# EAGLE design AccelTestJig (EAGLE 7.6.0)
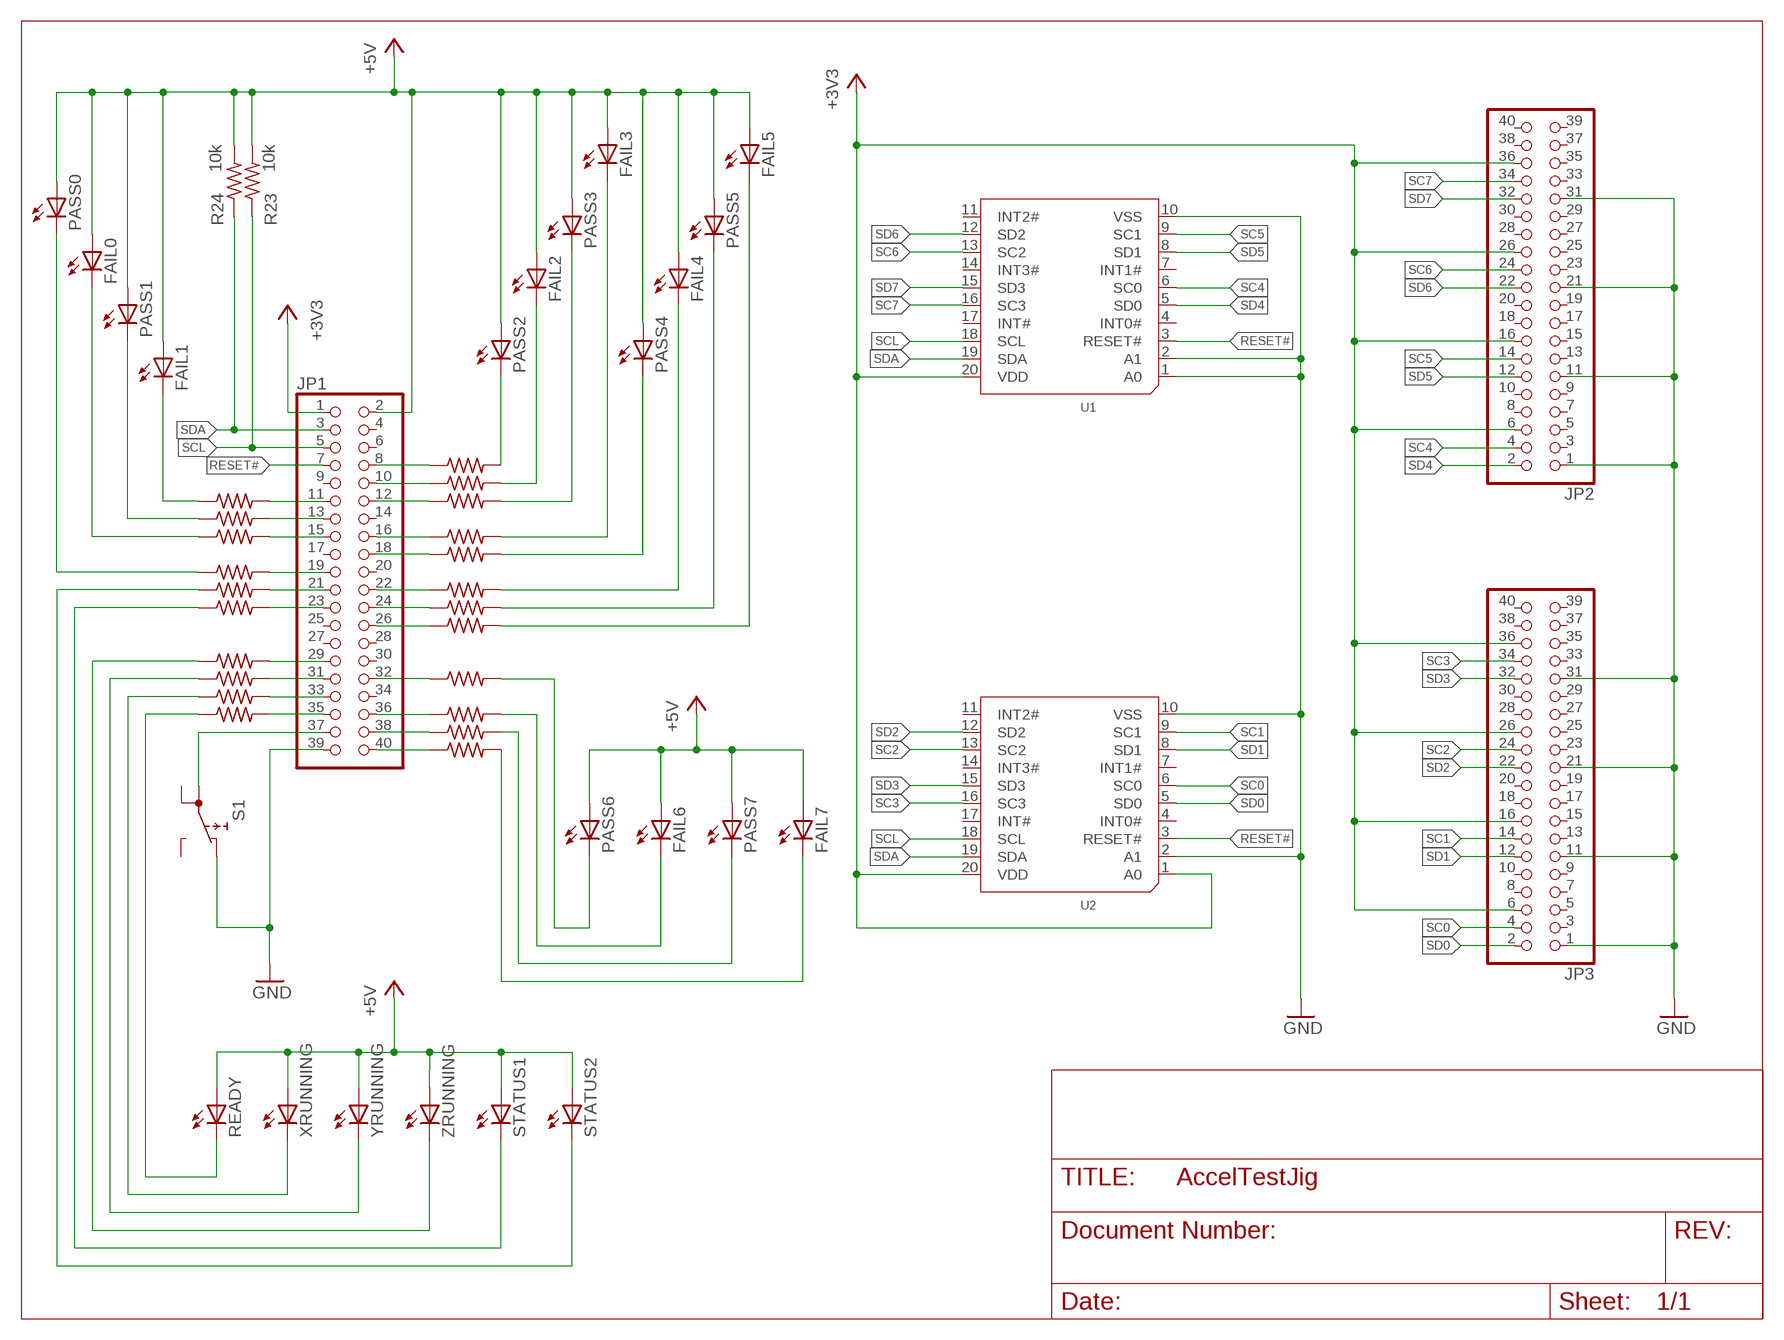
[diagram p0: schematic, sheet 1]

## Parts
FAIL0  FAIL  LEDCHIPLED_0805  [CHIPLED_0805]
FAIL1  FAIL  LEDCHIPLED_0805  [CHIPLED_0805]
FAIL2  FAIL  LEDCHIPLED_0805  [CHIPLED_0805]
FAIL3  FAIL  LEDCHIPLED_0805  [CHIPLED_0805]
FAIL4  FAIL  LEDCHIPLED_0805  [CHIPLED_0805]
FAIL5  FAIL  LEDCHIPLED_0805  [CHIPLED_0805]
FAIL6  FAIL  LEDCHIPLED_0805  [CHIPLED_0805]
FAIL7  FAIL  LEDCHIPLED_0805  [CHIPLED_0805]
JP1  NONE  PINHD-2X20  [2X20]
JP2  NONE  PINHD(2X20-WIDE)  [2X20-WIDE]
JP3  NONE  PINHD(2X20-WIDE)  [2X20-WIDE]
PASS0  PASS  LEDCHIPLED_0805  [CHIPLED_0805]
PASS1  PASS  LEDCHIPLED_0805  [CHIPLED_0805]
PASS2  PASS  LEDCHIPLED_0805  [CHIPLED_0805]
PASS3  PASS  LEDCHIPLED_0805  [CHIPLED_0805]
PASS4  PASS  LEDCHIPLED_0805  [CHIPLED_0805]
PASS5  PASS  LEDCHIPLED_0805  [CHIPLED_0805]
PASS6  PASS  LEDCHIPLED_0805  [CHIPLED_0805]
PASS7  PASS  LEDCHIPLED_0805  [CHIPLED_0805]
R1  100  R-US_R0805  [R0805]
R2  100  R-US_R0805  [R0805]
R3  100  R-US_R0805  [R0805]
R4  100  R-US_R0805  [R0805]
R5  100  R-US_R0805  [R0805]
R6  100  R-US_R0805  [R0805]
R7  100  R-US_R0805  [R0805]
R8  100  R-US_R0805  [R0805]
R9  100  R-US_R0805  [R0805]
R10  100  R-US_R0805  [R0805]
R11  100  R-US_R0805  [R0805]
R12  100  R-US_R0805  [R0805]
R13  100  R-US_R0805  [R0805]
R14  100  R-US_R0805  [R0805]
R15  100  R-US_R0805  [R0805]
R16  100  R-US_R0805  [R0805]
R17  100  R-US_R0805  [R0805]
R18  100  R-US_R0805  [R0805]
R19  100  R-US_R0805  [R0805]
R20  100  R-US_R0805  [R0805]
R21  100  R-US_R0805  [R0805]
R22  100  R-US_R0805  [R0805]
R23  10k  R-US_R0805  [R0805]
R24  10k  R-US_R0805  [R0805]
READY  READY  LEDCHIPLED_0805  [CHIPLED_0805]
S1  START  PUSHBUTTON(6X6SMD)01  [6X6SMD]
STATUS1  NONE  LEDCHIPLED_0805  [CHIPLED_0805]
STATUS2  NONE  LEDCHIPLED_0805  [CHIPLED_0805]
U1  NONE  PCA9545(SOIC20)  [SOIC20]
U2  NONE  PCA9545(SOIC20)  [SOIC20]
XRUNNING  TESTING X  LEDCHIPLED_0805  [CHIPLED_0805]
YRUNNING  TESTING Y  LEDCHIPLED_0805  [CHIPLED_0805]
ZRUNNING  TESTING Z  LEDCHIPLED_0805  [CHIPLED_0805]

## Nets
+3V3: JP1.1 JP2.6 JP2.16 JP2.26 JP2.36 JP3.6 JP3.16 JP3.26 JP3.36 U1.20(VDD) U2.1(A0) U2.20(VDD)
+5V: FAIL0.A FAIL1.A FAIL2.A FAIL3.A FAIL4.A FAIL5.A FAIL6.A FAIL7.A JP1.2 PASS0.A PASS1.A PASS2.A PASS3.A PASS4.A PASS5.A PASS6.A PASS7.A R23.2 R24.2 READY.A STATUS1.A STATUS2.A XRUNNING.A YRUNNING.A ZRUNNING.A
GND: JP1.39 JP2.1 JP2.11 JP2.21 JP2.31 JP3.1 JP3.11 JP3.21 JP3.31 S1.P$2 U1.1(A0) U1.2(A1) U1.10(VSS) U2.2(A1) U2.10(VSS)
N$1: JP1.11 R16.2
N$2: JP1.13 R17.2
N$3: JP1.15 R18.2
N$13: FAIL7.C R15.2
N$14: FAIL1.C R16.1
N$15: PASS1.C R17.1
N$16: FAIL0.C R18.1
N$17: JP1.19 R19.2
N$18: PASS0.C R19.1
N$19: JP1.8 R1.1
N$20: JP1.10 R2.1
N$21: JP1.12 R14.1
N$22: PASS2.C R1.2
N$23: FAIL2.C R2.2
N$24: PASS3.C R14.2
N$25: FAIL3.C R3.2
N$26: PASS4.C R4.2
N$27: FAIL4.C R5.2
N$28: PASS5.C R6.2
N$29: FAIL5.C R7.2
N$30: PASS7.C R10.2
N$31: FAIL6.C R9.2
N$32: PASS6.C R8.2
N$33: JP1.16 R3.1
N$34: JP1.18 R4.1
N$35: JP1.22 R5.1
N$36: JP1.24 R6.1
N$37: JP1.26 R7.1
N$38: JP1.32 R8.1
N$39: JP1.36 R9.1
N$40: JP1.38 R10.1
N$41: JP1.40 R15.1
N$42: R22.1 READY.C
N$43: R21.1 XRUNNING.C
N$44: R13.1 YRUNNING.C
N$46: R11.1 STATUS1.C
N$47: R20.1 STATUS2.C
N$48: JP1.21 R20.2
N$49: JP1.23 R11.2
N$50: JP1.29 R12.2
N$51: JP1.31 R13.2
N$52: JP1.33 R21.2
N$53: JP1.35 R22.2
N$54: JP1.37 S1.P$1
RESET#: JP1.7 U1.3(RESET#) U2.3(RESET#)
SC0: JP3.4 U2.6(SC0)
SC1: JP3.14 U2.9(SC1)
SC2: JP3.24 U2.13(SC2)
SC3: JP3.34 U2.16(SC3)
SC4: JP2.4 U1.6(SC0)
SC5: JP2.14 U1.9(SC1)
SC6: JP2.24 U1.13(SC2)
SC7: JP2.34 U1.16(SC3)
SCL: JP1.5 R23.1 U1.18(SCL) U2.18(SCL)
SD0: JP3.2 U2.5(SD0)
SD1: JP3.12 U2.8(SD1)
SD2: JP3.22 U2.12(SD2)
SD3: JP3.32 U2.15(SD3)
SD4: JP2.2 U1.5(SD0)
SD5: JP2.12 U1.8(SD1)
SD6: JP2.22 U1.12(SD2)
SD7: JP2.32 U1.15(SD3)
SDA: JP1.3 R24.1 U1.19(SDA) U2.19(SDA)
ZRUNNING: R12.1 ZRUNNING.C
Unconnected: JP1.4 JP1.6 JP1.9 JP1.14 JP1.17 JP1.20 JP1.25 JP1.27 JP1.28 JP1.30 JP1.34 JP2.3 JP2.5 JP2.7 JP2.8 JP2.9 JP2.10 JP2.13 JP2.15 JP2.17 JP2.18 JP2.19 JP2.20 JP2.23 JP2.25 JP2.27 JP2.28 JP2.29 JP2.30 JP2.33 JP2.35 JP2.37 JP2.38 JP2.39 JP2.40 JP3.3 JP3.5 JP3.7 JP3.8 JP3.9 JP3.10 JP3.13 JP3.15 JP3.17 JP3.18 JP3.19 JP3.20 JP3.23 JP3.25 JP3.27 JP3.28 JP3.29 JP3.30 JP3.33 JP3.35 JP3.37 JP3.38 JP3.39 JP3.40 S1.P$3 S1.P$4 U1.4(INT0#) U1.7(INT1#) U1.11(INT2#) U1.14(INT3#) U1.17(INT#) U2.4(INT0#) U2.7(INT1#) U2.11(INT2#) U2.14(INT3#) U2.17(INT#)

## Library data of the parts
FAIL0 FAIL1-FAIL7 PASS0 PASS1-PASS7 READY STATUS1 STATUS2 XRUNNING YRUNNING ZRUNNING = led:LED: LED OSRAM: - CHIPLED LG R971, LG N971, LY N971, LG Q971, LY Q971, LO R971, LY R971 LH N974, LH R974 LS Q976, LO Q976, LY Q976 LO Q996 - Hyper CHIPLED LW Q18S LB Q993, LB Q99A, LB R99A - SideLED LS A670, LO A670, LY A670, LG A670, LP A670 LB A673, LV A673, LT A673, LW A673 LH A674 LY A675 LS A676, LA A676, LO A676, LY A676, LW A676 LS A679, LY A679, LG A679 - Hyper Micro SIDELED® LS Y876, LA Y876, LO Y876, LY Y876 LT Y87S - SmartLED LW L88C, LW L88S LB L89C, LB L89S, LG L890 LS L89K, LO L89K, LY L89K LS L896, LA L896, LO L896, LY L896 - TOPLED LS T670, LO T670, LY T670, LG T670, LP T670 LSG T670, LSP T670, LSY T670, LOP T670, LYG T670 LG T671, LOG T671, LSG T671 LB T673, LV T673, LT T673, LW T673 LH T674 LS T676, LA T676, LO T676, LY T676, LB T676, LH T676, LSB T676, LW T676 LB T67C, LV T67C, LT T67C, LS T67K, LO T67K, LY T67K, LW E67C LS E67B, LA E67B, LO E67B, LY E67B, LB E67C, LV E67C, LT E67C LW T67C LS T679, LY T679, LG T679 LS T770, LO T770, LY T770, LG T770, LP T770 LB T773, LV T773, LT T773, LW T773 LH T774 LS E675, LA E675, LY E675, LS T675 LS T776, LA T776, LO T776, LY T776, LB T776 LHGB T686 LT T68C, LB T68C - Hyper Mini TOPLED® LB M676 - Mini TOPLED Santana® LG M470 LS M47K, LO M47K, LY M47K Source: http://www.osram.convergy.de LUXEON: - LUMILED® LXK2-PW12-R00, LXK2-PW12-S00, LXK2-PW14-U00, LXK2-PW14-V00 LXK2-PM12-R00, LXK2-PM12-S00, LXK2-PM14-U00 LXK2-PE12-Q00, LXK2-PE12-R00, LXK2-PE12-S00, LXK2-PE14-T00, LXK2-PE14-U00 LXK2-PB12-K00, LXK2-PB12-L00, LXK2-PB12-M00, LXK2-PB14-N00, LXK2-PB14-P00, LXK2-PB14-Q00 LXK2-PR12-L00, LXK2-PR12-M00, LXK2-PR14-Q00, LXK2-PR14-R00 LXK2-PD12-Q00, LXK2-PD12-R00, LXK2-PD12-S00 LXK2-PH12-R00, LXK2-PH12-S00 LXK2-PL12-P00, LXK2-PL12-Q00, LXK2-PL12-R00 Source: www.luxeon.com KINGBRIGHT: KA-3528ASYC Source: www.kingbright.com
JP1 = AccelTestJig:PINHD-2X20: PIN HEADER
JP2 JP3 = AccelTestJig:PINHD(2X20-WIDE): 2x20 0.6" wide through-hole socket
R1-R24 = resistor:R-US_: RESISTOR, American symbol
S1 = AccelTestJig:PUSHBUTTON(6X6SMD): PUSHBUTTON Digikey: CKN9112CT-ND
U1 U2 = AccelTestJig:PCA9545(SOIC20): I2C 4-channel switch

## Board
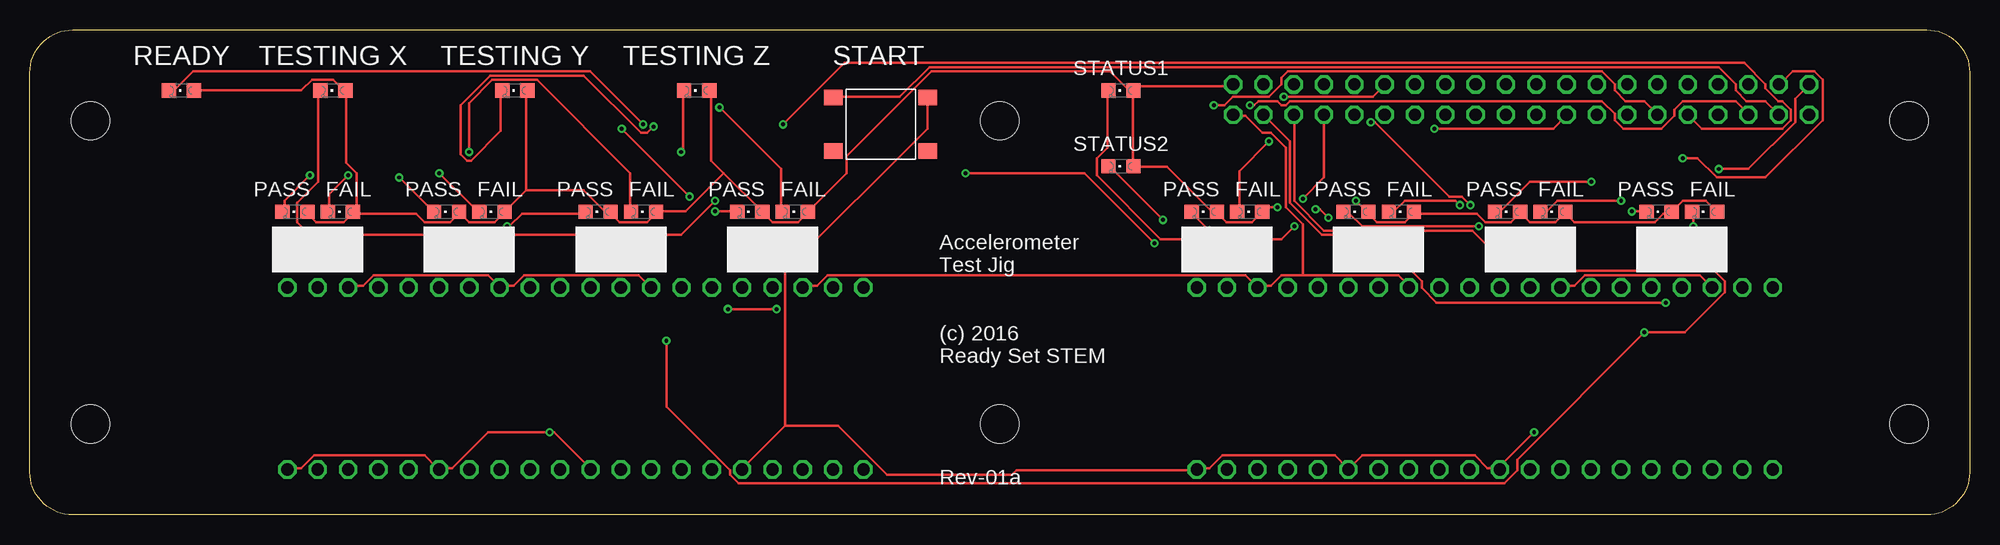
[diagram p1: board, top side]
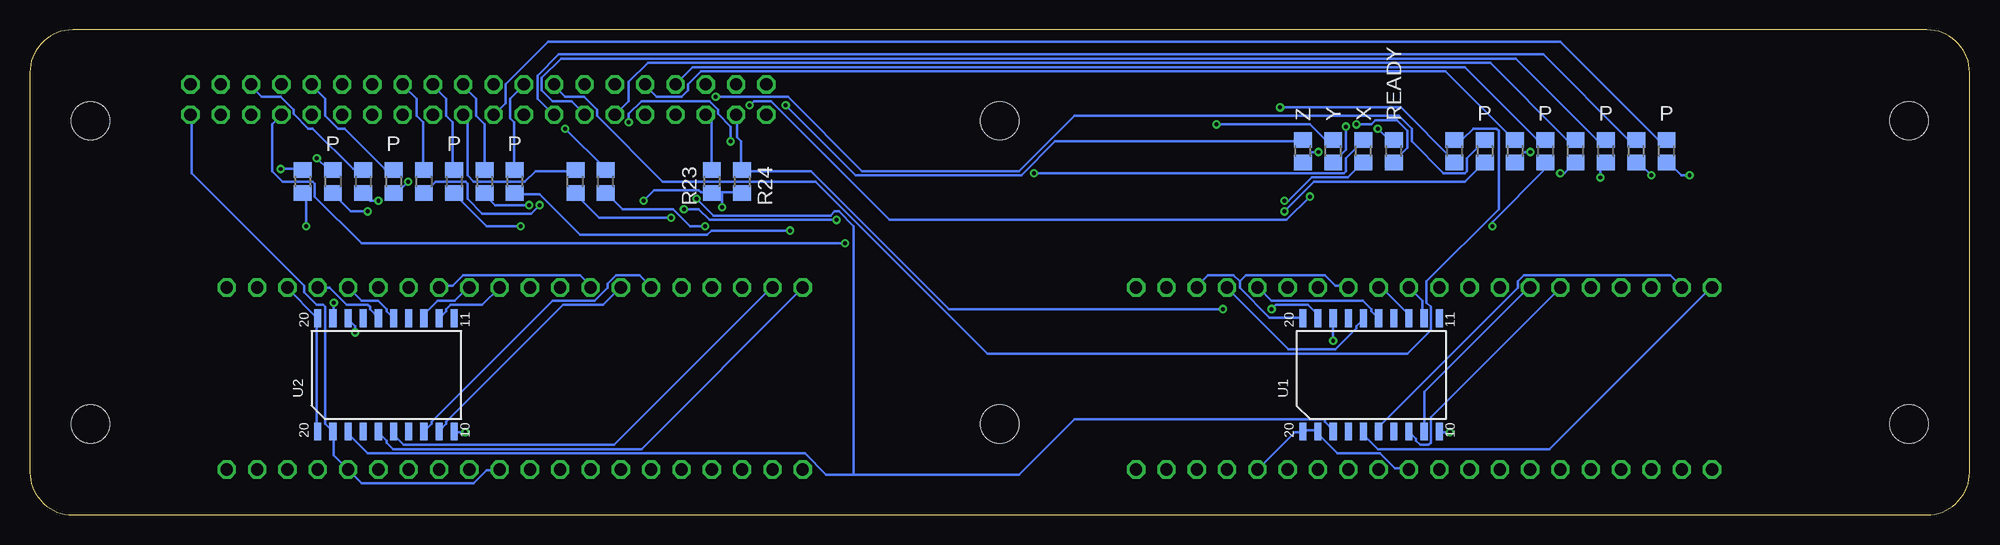
[diagram p2: board, bottom side, seen from below]

Size 162.56 x 40.64 mm. Coordinates in mm from the lower left corner, seen from the top.
Outline: 3.59,40.64 158.97,40.64 arc-90 162.56,37.05 162.56,3.59 arc-90 158.97,0 3.59,0 arc-90 0,3.59 0,37.05 arc-90 3.59,40.64
Copper layers (1*16): Top 0.0356mm / dielectric 1.5011mm / Bottom 0.0356mm
Design rules "LaenPCBOrder *": minimum track width 8mil, minimum drill 13mil, track to track 6mil, track to pad 6mil, pad to pad 6mil, via to via 6mil, smd to smd 6mil, copper to edge 15mil, drill to drill 6mil, minimum pad ring 7mil, minimum via ring 7mil, stop-mask expansion 3mil, vias tented up to drill 0mil, thermal gap 10mil
Holes 3.17 mm at 5.08,7.62 5.08,33.02 81.28,7.62 157.48,7.62 157.48,33.02 81.28,33.02
tRestrict: area 1.3,29.2 to 8.9,36.8; area 1.3,3.8 to 8.9,11.4; area 77.5,3.8 to 85.1,11.4; area 153.7,3.8 to 161.3,11.4; area 77.5,29.2 to 85.1,36.8; area 153.7,29.2 to 161.3,36.8
bRestrict: area 1.3,29.2 to 8.9,36.8; area 1.3,3.8 to 8.9,11.4; area 77.5,3.8 to 85.1,11.4; area 153.7,3.8 to 161.3,11.4; area 77.5,29.2 to 85.1,36.8; area 153.7,29.2 to 161.3,36.8
vRestrict: area 18.4,26.7 to 28.6,27.9; area 31.1,26.7 to 41.3,27.9; area 43.8,26.7 to 54,27.9; area 56.5,26.7 to 66.7,27.9; area 7.6,36.8 to 63.5,40.6; area 67.3,36.8 to 74.9,40.6; area 87.6,36.8 to 95.2,39.4; area 87.6,30.5 to 95.2,31.8; area 94.6,26.7 to 104.8,27.9; area 107.3,26.7 to 117.5,27.9; area 120,26.7 to 130.2,27.9; area 132.7,26.7 to 142.9,27.9; 3 more areas

### Footprints (pad centres in the part's own frame; a part is rotated, then mirrored left to right if it is on the bottom)
CHIPLED_0805 = smd 1.2 x 1.2: A 0,-1.05; C 0,1.05
2X20 = drill 1.016 octagon: 1 -24.13,-1.27; 2 -24.13,1.27; 3 -21.59,-1.27; 4 -21.59,1.27; 5 -19.05,-1.27; 6 -19.05,1.27; 7 -16.51,-1.27; 8 -16.51,1.27; 9 -13.97,-1.27; 10 -13.97,1.27; 11 -11.43,-1.27; 12 -11.43,1.27; 13 -8.89,-1.27; 14 -8.89,1.27; 15 -6.35,-1.27; 16 -6.35,1.27; 17 -3.81,-1.27; 18 -3.81,1.27; 19 -1.27,-1.27; 20 -1.27,1.27; 21 1.27,-1.27; 22 1.27,1.27; 23 3.81,-1.27; 24 3.81,1.27; 25 6.35,-1.27; 26 6.35,1.27; 27 8.89,-1.27; 28 8.89,1.27; 29 11.43,-1.27; 30 11.43,1.27; 31 13.97,-1.27; 32 13.97,1.27; 33 16.51,-1.27; 34 16.51,1.27; 35 19.05,-1.27; 36 19.05,1.27; 37 21.59,-1.27; 38 21.59,1.27; 39 24.13,-1.27; 40 24.13,1.27
2X20-WIDE = drill 1.016 octagon: 1 -24.13,-1.27; 2 -24.13,13.97; 3 -21.59,-1.27; 4 -21.59,13.97; 5 -19.05,-1.27; 6 -19.05,13.97; 7 -16.51,-1.27; 8 -16.51,13.97; 9 -13.97,-1.27; 10 -13.97,13.97; 11 -11.43,-1.27; 12 -11.43,13.97; 13 -8.89,-1.27; 14 -8.89,13.97; 15 -6.35,-1.27; 16 -6.35,13.97; 17 -3.81,-1.27; 18 -3.81,13.97; 19 -1.27,-1.27; 20 -1.27,13.97; 21 1.27,-1.27; 22 1.27,13.97; 23 3.81,-1.27; 24 3.81,13.97; 25 6.35,-1.27; 26 6.35,13.97; 27 8.89,-1.27; 28 8.89,13.97; 29 11.43,-1.27; 30 11.43,13.97; 31 13.97,-1.27; 32 13.97,13.97; 33 16.51,-1.27; 34 16.51,13.97; 35 19.05,-1.27; 36 19.05,13.97; 37 21.59,-1.27; 38 21.59,13.97; 39 24.13,-1.27; 40 24.13,13.97
R0805 = smd 1.3 x 1.5: 1 -0.95,0; 2 0.95,0
6X6SMD = smd 1.55 x 1.3: P$1 0,4.5; P$2 7.95,4.5; P$3 0,0; P$4 7.95,0
SOIC20 = smd 0.6 x 1.5: 1 0,0; 2 1.27,0; 3 2.54,0; 4 3.81,0; 5 5.08,0; 6 6.35,0; 7 7.62,0; 8 8.89,0; 9 10.16,0; 10 11.43,0; 11 11.43,9.5; 12 10.16,9.5; 13 8.89,9.5; 14 7.62,9.5; 15 6.35,9.5; 16 5.08,9.5; 17 3.81,9.5; 18 2.54,9.5; 19 1.27,9.5; 20 0,9.5

### Placement (x,y rotation side)
FAIL0  26.04,25.4 90 top
FAIL1  38.73,25.4 90 top
FAIL2  51.44,25.4 90 top
FAIL3  64.14,25.4 90 top
FAIL4  102.23,25.4 90 top
FAIL5  114.94,25.4 90 top
FAIL6  127.64,25.4 90 top
FAIL7  140.34,25.4 90 top
JP1  124.97,34.8 0 top
JP2  45.72,5.08 0 top
JP3  121.92,5.08 0 top
PASS0  22.23,25.4 90 top
PASS1  34.92,25.4 90 top
PASS2  47.62,25.4 90 top
PASS3  60.33,25.4 90 top
PASS4  98.42,25.4 90 top
PASS5  111.12,25.4 90 top
PASS6  123.83,25.4 90 top
PASS7  136.53,25.4 90 top
R1  35.56,30.48 270 bottom
R2  38.1,30.48 270 bottom
R3  43.18,30.48 270 bottom
R4  121.92,27.94 270 bottom
R5  124.46,27.94 270 bottom
R6  127,27.94 270 bottom
R7  129.54,27.94 270 bottom
R8  132.08,27.94 270 bottom
R9  134.62,27.94 270 bottom
R10  137.16,27.94 270 bottom
R11  114.3,27.94 90 bottom
R12  55.88,30.48 90 bottom
R13  53.34,30.48 90 bottom
R14  40.64,30.48 270 bottom
R15  139.7,27.94 270 bottom
R16  33.02,30.48 90 bottom
R17  30.48,30.48 90 bottom
R18  27.94,30.48 90 bottom
R19  25.4,30.48 90 bottom
R20  116.84,27.94 90 bottom
R21  50.8,30.48 90 bottom
R22  48.26,30.48 90 bottom
R23  105.41,27.94 270 bottom
R24  102.87,27.94 270 bottom
READY  12.7,35.56 90 top
S1  67.31,30.48 0 top
STATUS1  91.44,35.56 90 top
STATUS2  91.44,29.21 90 top
U1  55.88,6.99 0 bottom
U2  138.43,6.99 0 bottom
XRUNNING  25.4,35.56 90 top
YRUNNING  40.64,35.56 90 top
ZRUNNING  55.88,35.56 90 top

### Tracks (layer width: path | path; a pad name or v marks a point on that pad's centre or on a via)
+3V3
  Top 0.203: JP2.6 26.67,19.2 27.91,19.2 28.8,20.09 38.41,20.09 39.29,19.2 JP2.16 39.47,19.2 40.54,19.2 41.43,20.09 51.03,20.09 JP2.26 | JP3.36 139.93,20.09 130.33,20.09 129.44,19.2 128.37,19.2 JP3.26 | 106.68,20.09 114.68,20.09 115.57,19.2 JP3.16 | 106.68,20.09 104.9,20.09 104.01,19.2 102.95,19.2 JP3.6 102.77,19.2 101.88,20.09 66.85,20.09 65.96,19.2 64.9,19.2 JP2.36 | 106.68,20.09 106.68,24.36 105.26,25.78 105.26,30.76 104.01,32 103.3,32 101.88,33.43 100.99,33.43 JP1.1
  Bottom 0.203: 61.16,19.56 61.16,19.02 58.67,16.54 56.01,16.54 U1.20 | 61.16,19.56 61.7,20.09 63.83,20.09 64.72,19.2 JP2.36 | 61.16,19.56 60.63,20.09 54.05,20.09 53.16,19.2 52.09,19.2 JP2.26 | U2.1 138.51,7.11 138.51,16.36 U2.20 138.51,16.54 141,19.02 JP3.36 | JP3.26 128.19,19.2 127.13,19.2 126.24,20.09 116.46,20.09 115.57,19.2 JP3.16
+5V  (via drill 0.33)
  Top 0.203: v104.55,25.78 103.66,25.78 103.3,25.43 FAIL4.A 103.12,25.25 102.41,24.54 100.28,24.54 99.57,25.25 PASS4.A 99.39,25.43 99.03,25.43 95.3,29.16 92.63,29.16 STATUS2.A 92.46,29.34 92.46,35.56 | JP1.2 100.81,35.92 92.99,35.92 92.63,35.56 STATUS1.A 92.46,35.56 | FAIL7.A 141.35,25.43 140.46,26.31 138.51,26.31 137.62,25.43 PASS7.A 137.44,25.25 136.91,25.25 136.19,24.54 129.44,24.54 128.73,25.25 FAIL6.A 128.55,25.25 127.84,24.54 125.7,24.54 124.99,25.25 PASS6.A 124.82,25.25 124.1,24.54 121.97,24.54 121.26,25.25 116.1,25.25 FAIL5.A 115.93,25.25 115.21,24.54 112.9,24.54 112.19,25.25 PASS5.A 112.01,25.43 v111.12,26.31 | 58.14,28.63 61.34,25.43 PASS3.A 61.52,25.25 62.23,24.54 64.36,24.54 65.08,25.25 FAIL3.A 65.25,25.43 68.45,28.63 68.45,30.05 75.56,37.16 90.5,37.16 92.1,35.56 92.46,35.56 | 58.14,28.63 57.07,29.69 57.07,35.56 ZRUNNING.A | 58.14,28.63 54.94,25.43 52.63,25.43 FAIL2.A 52.45,25.25 51.74,24.54 49.43,24.54 48.72,25.25 PASS2.A 48.54,25.43 48.18,25.43 46.41,27.2 41.6,27.2 | READY.A 22.76,35.56 23.65,36.45 25.43,36.45 26.31,35.56 XRUNNING.A 26.49,35.56 26.49,29.52 27.38,28.63 27.38,25.25 | PASS0.A 23.29,25.25 24,24.54 26.31,24.54 27.03,25.25 FAIL0.A | 41.6,27.2 41.6,35.56 YRUNNING.A | 41.6,27.2 39.83,25.43 FAIL1.A 39.65,25.25 38.94,24.54 36.8,24.54 36.09,25.25 PASS1.A 35.92,25.25 35.2,24.54 33.07,24.54 32.36,25.25 27.38,25.25 | 27.38,25.25 27.2,25.25 FAIL0.A | 27.38,25.25 FAIL0.A
  Bottom 0.203: 104.55,27.03 105.26,27.03 R23.2 105.44,27.03 106.32,27.03 106.5,27.2 110.24,27.2 v111.12,26.31 | 104.55,27.03 102.95,27.03 R24.2 | v104.55,25.78 104.55,27.03
GND  (via drill 0.33)
  Top 0.203: 123.04,3.91 v126.06,6.93 | 123.04,3.91 122.15,3.91 121.08,4.98 111.66,4.98 JP3.11 110.41,3.91 109.35,4.98 99.92,4.98 98.86,3.91 97.79,3.91 JP3.1 97.79,3.73 82.68,3.73 82.32,3.38 71.83,3.38 67.74,7.47 63.3,7.47 | 123.04,3.91 JP3.21 | JP2.1 21.69,3.91 22.76,3.91 23.82,4.98 33.07,4.98 34.14,3.91 JP2.11 34.31,3.91 35.38,3.91 38.41,6.93 v43.56,6.93 43.92,6.93 46.94,3.91 JP2.21 | 63.3,7.47 63.3,20.45 75.21,32.36 75.21,34.85 S1.P$2 | 63.3,7.47 59.74,3.91 JP2.31
  Bottom 0.203: v126.06,6.93 126.95,6.93 U2.10 | JP1.39 149,33.43 149,28.63 139.57,19.2 139.57,18.67 138.51,17.6 137.97,17.6 137.79,17.42 137.79,7.64 137.26,7.11 U2.2 137.08,6.93 137.08,4.98 136.02,3.91 JP3.31 135.84,3.73 134.77,2.67 125.35,2.67 124.28,3.73 123.22,3.73 JP3.21 | v43.56,6.93 44.45,6.93 U1.10 | JP2.31 59.56,3.91 56.54,6.93 56.01,6.93 U1.1 55.83,7.11 54.76,7.11 U1.2 54.76,6.93 52.98,5.16 49.43,5.16 48.18,3.91 47.12,3.91 JP2.21
N$1
  Bottom 0.203: R16.2 33.07,31.47 33.78,31.47 40.18,37.87 110.77,37.87 112.37,36.27 112.37,34.67 113.44,33.6 JP1.11
N$2
  Bottom 0.203: R17.2 30.58,31.47 31.29,31.47 38.05,38.23 118.06,38.23 119.66,36.63 119.66,35.56 118.77,34.67 117.17,34.67 116.1,33.6 JP1.13
N$3
  Bottom 0.203: R18.2 28.09,31.47 28.63,31.47 35.74,38.58 118.24,38.58 120.02,36.8 120.02,34.85 118.77,33.6 JP1.15
N$13  (via drill 0.33)
  Top 0.203: v139.4,24.18 139.4,25.25 FAIL7.C
  Bottom 0.203: v139.4,24.18 139.4,26.67 139.57,26.85 R15.2
N$14  (via drill 0.33)
  Top 0.203: v34.31,28.63 37.52,25.43 FAIL1.C
  Bottom 0.203: v34.31,28.63 33.96,28.63 33.07,29.52 R16.1
N$15  (via drill 0.33)
  Top 0.203: v30.94,28.27 33.78,25.43 PASS1.C
  Bottom 0.203: v30.94,28.27 30.94,29.16 30.58,29.52 R17.1
N$16  (via drill 0.33)
  Top 0.203: v26.67,28.45 25.07,26.85 25.07,25.43 FAIL0.C
  Bottom 0.203: v26.67,28.45 27.91,29.69 R18.1
N$17
  Bottom 0.203: R19.2 25.43,31.47 26.14,31.47 34.31,39.65 119.13,39.65 122.68,36.09 122.68,34.49 123.57,33.6 JP1.19
N$18  (via drill 0.33)
  Top 0.203: v23.47,28.45 21.34,26.31 21.34,25.43 PASS0.C
  Bottom 0.203: v23.47,28.45 24.18,28.45 25.25,29.52 R19.1
N$19
  Bottom 0.203: R1.1 35.56,31.47 36.27,31.47 42.32,37.52 107.04,37.52 108.46,36.09 JP1.8
N$20
  Bottom 0.203: R2.1 38.23,31.47 43.92,37.16 106.32,37.16 107.39,36.09 107.39,35.56 107.92,35.03 110.06,35.03 110.95,35.92 JP1.10
N$21  (via drill 0.33)
  Top 0.203: v105.08,35.03 112.55,35.03 113.44,35.92 JP1.12
  Bottom 0.203: v105.08,35.03 99.03,35.03 92.81,28.8 79.65,28.8 75.03,33.43 47.83,33.43 46.76,32.36 46.76,31.29 44.09,28.63 42.32,28.63 42.14,28.8 42.14,29.87 40.72,31.29 R14.1
N$22  (via drill 0.33)
  Top 0.203: v40.01,24.18 40.18,24.18 41.25,25.25 46.41,25.25 PASS2.C
  Bottom 0.203: v40.01,24.18 40.01,24.54 35.56,28.98 R1.2
N$23  (via drill 0.33)
  Top 0.203: v36.8,30.4 36.8,34.49 38.76,36.45 42.49,36.45 50.32,28.63 50.32,25.43 FAIL2.C
  Bottom 0.203: v36.8,30.4 37.34,30.4 38.05,29.69 R2.2
N$24  (via drill 0.33)
  Top 0.203: v57.43,25.43 59.21,25.43 PASS3.C
  Bottom 0.203: v57.43,25.43 54.94,27.91 42.32,27.91 40.72,29.52 R14.2
N$25  (via drill 0.33)
  Top 0.203: v57.78,34.14 62.94,28.98 62.94,25.43 FAIL3.C
  Bottom 0.203: v57.78,34.14 47.65,34.14 43.2,29.69 R3.2
N$26  (via drill 0.33)
  Top 0.203: v98.86,23.82 97.43,25.25 PASS4.C
  Bottom 0.203: v98.86,23.82 105.44,23.82 105.79,23.47 116.46,23.47 119.84,26.85 121.79,26.85 R4.2
N$27  (via drill 0.33)
  Top 0.203: v103.83,31.29 101.35,28.8 101.35,25.43 FAIL4.C | v112.37,32.89 112.72,32.89 118.95,26.67 120.02,26.67 v120.73,25.96
  Bottom 0.203: v103.83,31.29 103.83,32.54 104.9,33.6 104.9,33.96 105.61,34.67 111.3,34.67 112.37,33.6 v112.37,32.89 | v120.73,25.96 123.57,25.96 124.46,26.85 R5.2
N$28  (via drill 0.33)
  Top 0.203: v121.44,24.18 111.66,24.18 110.59,25.25 110.24,25.25 PASS5.C
  Bottom 0.203: v121.44,24.18 124.28,24.18 126.95,26.85 R6.2
N$29  (via drill 0.33)
  Top 0.203: v119.84,25.96 119.48,26.31 115.21,26.31 114.33,25.43 113.97,25.43 FAIL5.C
  Bottom 0.203: v119.84,25.96 120.55,25.25 124.64,25.25 125.88,26.49 125.88,27.74 126.06,27.91 128.55,27.91 129.44,27.03 R7.2
N$30  (via drill 0.33)
  Top 0.203: v134.24,25.43 135.31,25.43 PASS7.C
  Bottom 0.203: v134.24,25.43 135.66,25.43 137.08,26.85 R10.2
N$31  (via drill 0.33)
  Top 0.203: v133.35,26.31 128.02,26.31 127.13,25.43 126.59,25.43 FAIL6.C
  Bottom 0.203: v133.35,26.31 134.06,26.31 134.59,26.85 R9.2
N$32  (via drill 0.33)
  Top 0.203: v130.86,27.91 125.7,27.91 123.22,25.43 122.86,25.43 PASS6.C
  Bottom 0.203: v130.86,27.91 131.93,26.85 R8.2
N$33
  Bottom 0.203: R3.1 43.03,31.47 42.49,31.47 41.6,32.36 39.65,32.36 39.47,32.18 39.47,25.6 45.52,19.56 45.52,17.78 45.16,17.42 45.16,15.47 47.12,13.51 82.32,13.51 96.72,27.91 109.53,27.91 115.04,33.43 115.04,33.96 116.1,35.03 117.7,35.03 118.59,35.92 JP1.16
N$34
  Bottom 0.203: R4.1 121.97,28.98 121.97,32.89 122.33,33.25 122.33,34.85 121.26,35.92 JP1.18
N$35
  Bottom 0.203: R5.1 124.46,32.72 125.17,33.43 125.17,34.85 126.24,35.92 JP1.22
N$36
  Bottom 0.203: R6.1 127.13,28.98 127.13,32.89 127.66,33.43 127.66,34.85 128.73,35.92 JP1.24
N$37
  Bottom 0.203: R7.1 129.62,28.98 129.62,32.89 130.15,33.43 130.15,34.85 131.22,35.92 JP1.26
N$38
  Bottom 0.203: R8.1 132.1,28.98 132.82,28.98 136.19,32.36 136.73,32.36 137.79,33.43 137.79,34.85 138.86,35.92 JP1.32
N$39
  Bottom 0.203: R9.1 134.77,28.98 135.48,28.98 138.86,32.36 139.22,32.36 140.46,33.6 140.46,33.96 141.53,35.03 143.13,35.03 144.02,35.92 JP1.36
N$40  (via drill 0.33)
  Top 0.203: v138.51,29.87 139.75,29.87 141.35,28.27 145.44,28.27 150.24,33.07 150.24,36.45 149.53,37.16 147.75,37.16 146.69,36.09 JP1.38
  Bottom 0.203: v138.51,29.87 137.62,28.98 137.26,28.98 R10.1
N$41  (via drill 0.33)
  Top 0.203: v141.53,28.98 144.02,28.98 147.93,32.89 147.93,34.85 149,35.92 JP1.40
  Bottom 0.203: v141.53,28.98 139.75,28.98 R15.1
N$42  (via drill 0.33)
  Top 0.203: READY.C 12.09,35.56 13.69,37.16 46.94,37.16 v51.38,32.72
  Bottom 0.203: v51.38,32.72 50.14,32.72 49.78,33.07 48.01,33.07 47.12,32.18 47.12,30.76 48.18,29.69 R22.1
N$43  (via drill 0.33)
  Top 0.203: v57.43,26.31 54.59,23.47 23.47,23.47 22.4,24.54 22.4,26.14 24.18,27.91 24.18,35.56 XRUNNING.C
  Bottom 0.203: v57.43,26.31 57.07,26.31 55.12,28.27 52.09,28.27 50.85,29.52 R21.1
N$44  (via drill 0.33)
  Top 0.203: v52.27,32.54 51.74,32 51.21,32 46.41,36.8 38.58,36.8 36.09,34.31 36.09,30.23 36.63,29.69 36.98,29.69 39.47,32.18 39.47,35.56 YRUNNING.C
  Bottom 0.203: v52.27,32.54 52.27,30.58 53.34,29.52 R13.1
N$46  (via drill 0.33)
  Top 0.203: v105.97,24.18 104.9,23.11 94.77,23.11 89.43,28.45 89.43,29.87 90.32,30.76 90.32,35.56 STATUS1.C
  Bottom 0.203: v105.97,24.18 107.21,24.18 108.64,25.6 112.9,25.6 114.15,26.85 R11.1
N$47  (via drill 0.33)
  Top 0.203: v94.94,24.71 90.5,29.16 STATUS2.C | v107.75,25.6 108.1,25.6 v108.81,24.89
  Bottom 0.203: v94.94,24.71 105.61,24.71 106.5,25.6 v107.75,25.6 | v108.81,24.89 114.86,24.89 116.81,26.85 R20.1
N$48
  Bottom 0.203: R20.2 116.99,28.8 120.19,28.8 121.08,27.91 125.35,27.91 125.88,28.45 125.88,33.07 126.24,33.43 JP1.21
N$49  (via drill 0.33)
  Top 0.203: v117.7,32.36 127.66,32.36 128.73,33.43 JP1.23
  Bottom 0.203: v117.7,32.36 114.33,28.98 R11.2
N$50  (via drill 0.33)
  Top 0.203: v99.21,34.31 100.1,34.31 100.81,35.03 103.83,35.03 104.9,36.09 104.9,36.63 105.44,37.16 131.75,37.16 132.82,36.09 132.82,35.56 133.71,34.67 135.31,34.67 136.37,33.6 JP1.29
  Bottom 0.203: v99.21,34.31 93.34,28.45 79.48,28.45 76.63,31.29 56.01,31.29 R12.2
N$51  (via drill 0.33)
  Top 0.203: v63.12,32.72 68.28,37.87 143.66,37.87 145.44,36.09 145.44,35.74 146.51,34.67 146.86,34.67 147.57,33.96 147.57,33.07 146.86,32.36 140.11,32.36 JP1.31
  Bottom 0.203: v63.12,32.72 55.3,32.72 54.05,31.47 53.34,31.47 R13.2
N$52  (via drill 0.33)
  Top 0.203: v78.41,28.63 88.37,28.63 v94.23,22.76
  Bottom 0.203: v78.41,28.63 52.45,28.63 52.27,28.8 52.27,29.87 50.85,31.29 R21.2 | v94.23,22.76 134.77,22.76 138.68,26.67 138.68,27.74 138.86,27.91 141.35,27.91 142.24,28.8 142.24,32.72 141.53,33.43 JP1.33
N$53  (via drill 0.33)
  Top 0.203: v55.3,26.67 v49.61,32.36 | v102.23,34.31 102.59,34.31 102.95,34.67 104.55,34.67 104.9,34.31 105.26,34.31 105.61,34.67 131.75,34.67 132.82,33.6 132.82,33.07 133.53,32.36 136.73,32.36 137.79,33.43 137.79,33.96 138.51,34.67 142.95,34.67 144.02,33.6 JP1.35
  Bottom 0.203: v49.61,32.36 48.72,31.47 48.36,31.47 R22.2 | v55.3,26.67 57.25,24.71 90.5,24.71 100.46,34.67 101.88,34.67 v102.23,34.31
N$54
  Top 0.203: S1.P$1 67.39,35.03 72.9,35.03 75.39,37.52 141.53,37.52 142.95,36.09 142.95,35.56 143.84,34.67 145.44,34.67 146.51,33.6 JP1.37
RESET#  (via drill 0.33)
  Top 0.203: JP1.7 108.46,28.27 v106.68,26.49
  Bottom 0.203: 93.52,3.38 95.83,3.38 97.61,5.16 134.24,5.16 136.02,6.93 U2.3 | 93.52,3.38 79.65,3.38 75.03,8 54.05,8 54.05,7.82 53.34,7.11 U1.3 | v106.68,26.49 105.26,25.07 95.48,25.07 95.12,25.43 94.77,25.43 93.52,24.18 93.52,3.38
SC0
  Bottom 0.203: U2.6 131.93,6.93 131.93,6.58 131.22,5.87 113.61,5.87 100.46,19.02 JP3.4
SC1
  Bottom 0.203: U2.9 128.19,7.11 127.66,7.64 127.66,7.82 117.88,17.6 114.5,17.6 113.08,19.02 JP3.14
SC2
  Bottom 0.203: U2.13 129.44,16.54 129.44,16.89 128.37,17.96 126.95,17.96 125.88,19.02 JP3.24
SC3
  Bottom 0.203: U2.16 133.35,16.54 134.06,17.25 134.06,17.42 134.24,17.6 136.02,17.6 137.44,19.02 138.33,19.02 JP3.34
SC4
  Bottom 0.203: U1.6 49.43,7.11 49.43,7.47 37.87,19.02 37.87,19.56 37.34,20.09 25.07,20.09 24.18,19.2 JP2.4
SC5
  Bottom 0.203: U1.9 45.7,7.11 45.7,10.31 36.98,19.02 JP2.14
SC6
  Bottom 0.203: U1.13 47.12,16.54 47.12,16.89 49.43,19.2 JP2.24
SC7
  Bottom 0.203: U1.16 50.85,16.36 51.38,15.82 51.38,15.65 53.16,13.87 57.07,13.87 62.23,19.02 JP2.34
SCL  (via drill 0.33)
  Top 0.203: v53.34,14.58 53.34,9.07 58.67,3.73 58.67,3.38 59.38,2.67 123.57,2.67 124.64,3.73 124.64,4.62 v135.31,15.29 138.68,15.29 142.06,18.67 142.06,19.56 141.17,20.45 124.28,20.45 120.9,23.82 108.46,23.82 105.97,26.31 105.97,33.43 JP1.5
  Bottom 0.203: R23.1 105.44,28.98 105.44,33.07 105.79,33.43 JP1.5 | v53.34,14.58 U1.18 | v135.31,15.29 135.31,15.82 135.84,16.36 U2.18
SD0
  Bottom 0.203: U2.5 133.35,6.93 132.64,6.22 132.64,6.04 132.1,5.51 111.3,5.51 97.79,19.02 JP3.2
SD1
  Bottom 0.203: U2.8 129.44,7.11 128.91,7.64 128.91,7.82 118.77,17.96 115.21,17.96 114.15,19.02 114.15,19.38 113.44,20.09 111.48,20.09 110.59,19.2 JP3.12
SD2
  Bottom 0.203: JP3.22 124.64,17.6 127.31,17.6 127.66,17.25 127.66,17.07 128.19,16.54 U2.12
SD3
  Bottom 0.203: U2.15 132.1,16.54 132.64,17.07 132.64,17.25 133.35,17.96 134.77,17.96 135.84,19.02 JP3.32
SD4
  Bottom 0.203: U1.5 50.67,6.93 50.67,6.58 49.61,5.51 35.2,5.51 21.69,19.02 JP2.2
SD5
  Bottom 0.203: U1.8 46.41,6.4 46.41,6.22 46.05,5.87 45.34,5.87 45.16,6.04 45.16,8.18 JP2.12
SD6
  Bottom 0.203: U1.12 45.87,16.54 45.87,17.96 46.94,19.02 JP2.22
SD7
  Bottom 0.203: U1.15 49.61,16.54 50.14,17.07 50.14,17.25 50.85,17.96 58.5,17.96 59.56,19.02 JP2.32
SDA  (via drill 0.33)
  Top 0.203: v137.08,17.78 117.88,17.78 116.64,19.02 116.64,19.56 112.72,23.47 108.28,23.47 105.61,26.14 105.61,31.29 JP1.3 | v62.59,17.25 v58.5,17.25
  Bottom 0.203: v137.08,17.78 137.08,16.54 U2.19 | v58.5,17.25 58.14,17.6 55.47,17.6 54.76,16.89 54.76,16.54 U1.19 | v62.59,17.25 85.52,17.25 97.08,28.8 102.77,28.8 R24.1 102.95,28.98 102.95,31.29 103.3,31.65 103.3,33.43 JP1.3
ZRUNNING  (via drill 0.33)
  Top 0.203: v54.59,30.4 54.76,30.58 54.76,35.56 ZRUNNING.C
  Bottom 0.203: v54.59,30.4 55.12,30.4 55.83,29.69 R12.1

### Text on the board
tPlace: Accelerometer / Test Jig | (c) 2016 / Ready Set STEM | Rev-01a
bPlace: P | P | P | P | READY | X | Y | Z | P | P | P | P